# EAGLE schematic main (EAGLE 9.6.2)
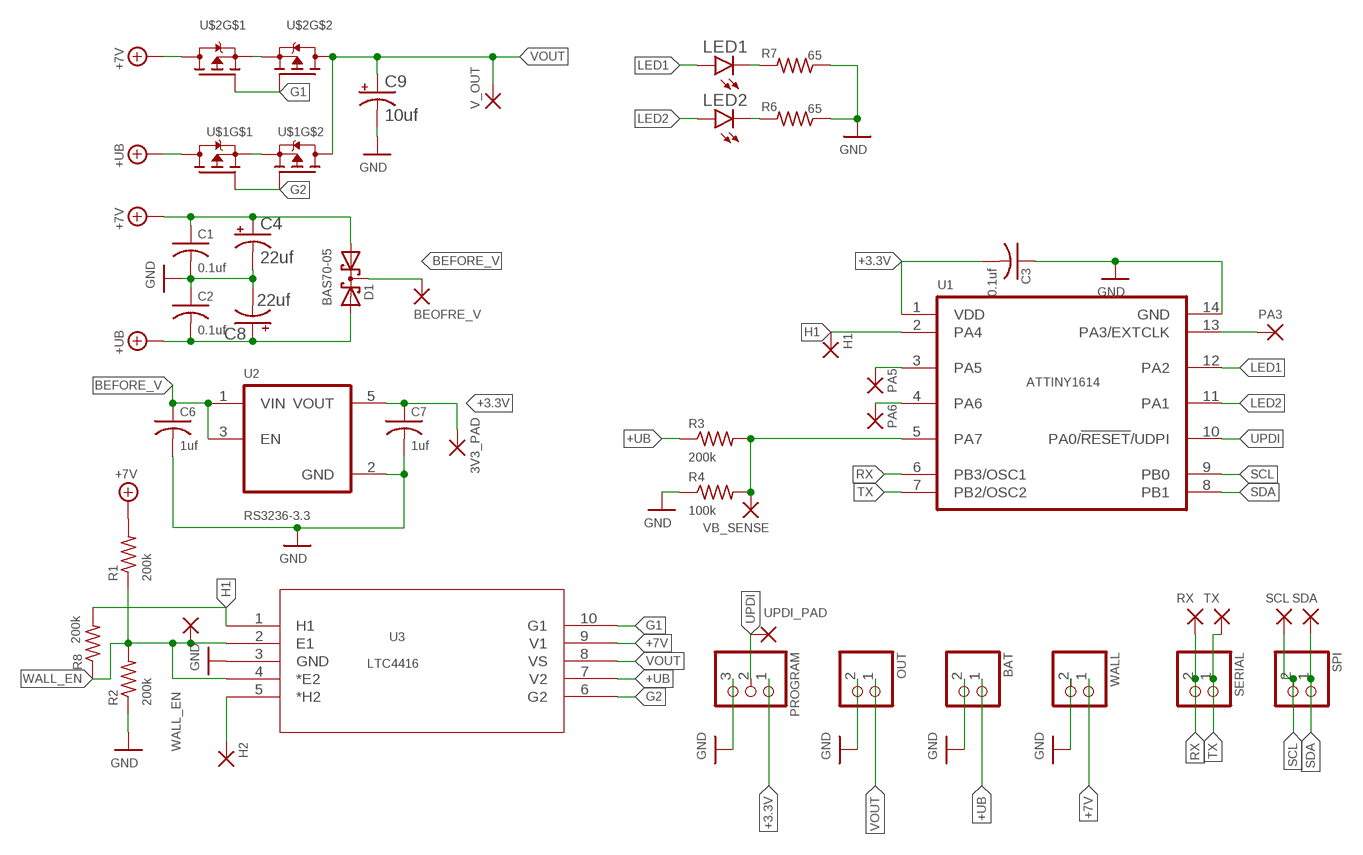
[diagram p0: schematic, sheet 1]

## Parts
3V3_PAD  SMD2  [SMD1,27-2,54]
BAT  PINHD-1X2  [1X02]
BEOFRE_V  SMD2  [SMD1,27-2,54]
C1  0.1uf  C-USC0805  [C0805]
C2  0.1uf  C-USC0805  [C0805]
C3  0.1uf  C-USC0805  [C0805]
C4  22uf  CPOL-US153CLV-0405  [153CLV-0405]
C6  1uf  C-USC1210  [C1210]
C7  1uf  C-USC1210  [C1210]
C8  22uf  CPOL-US153CLV-0405  [153CLV-0405]
C9  10uf  CPOL-US153CLV-0405  [153CLV-0405]
D1  BAS70-05  [SOT23]
H1  SMD2  [SMD1,27-2,54]
H2  SMD2  [SMD1,27-2,54]
LED1  LEDCHIP-LED0805  [CHIP-LED0805]
LED2  LEDCHIP-LED0805  [CHIP-LED0805]
OUT  PINHD-1X2  [1X02]
PA3  SMD2  [SMD1,27-2,54]
PA5  SMD2  [SMD1,27-2,54]
PA6  SMD2  [SMD1,27-2,54]
PROGRAM  PINHD-1X3  [1X03]
R1  200k  R-US_R0805  [R0805]
R2  200k  R-US_R0805  [R0805]
R3  200k  R-US_R0805  [R0805]
R4  100k  R-US_R0805  [R0805]
R6  65  R-US_R0805  [R0805]
R7  65  R-US_R0805  [R0805]
R8  200k  R-US_R0805  [R0805]
RX  SMD2  [SMD1,27-2,54]
SCL  SMD2  [SMD1,27-2,54]
SDA  SMD2  [SMD1,27-2,54]
SERIAL  PINHD-1X2  [1X02]
SPI  PINHD-1X2  [1X02]
TX  SMD2  [SMD1,27-2,54]
U1  ATTINY1614  ATTINY1614-SSNR  [SOIC127P600X175-14N]
U2  RS3236-3.3  AP2112K-3.3TRG1  [SOT95P285X140-5N]
U3  LTC4416  LTC4416IMS#PBF  [MSOP-10_MS]
U$1  IRF7314PBF  [SO-8]
U$2  IRF7314PBF  [SO-8]
UPDI_PAD  SMD2  [SMD1,27-2,54]
V_OUT  SMD2  [SMD1,27-2,54]
VB_SENSE  SMD2  [SMD1,27-2,54]
WALL  PINHD-1X2  [1X02]
WALL_EN  SMD2  [SMD1,27-2,54]

## Nets
+3.3V: 3V3_PAD.1(P) C3.2 C7.1 PROGRAM.1 U1.1(VDD) U2.5(VOUT)
+7V: C1.1 C4.+ D1.1(A1) R1.2 U3.9(V1) U$2.7(D) U$2.8(D) WALL.1
+UB: BAT.1 C2.2 C8.+ D1.2(A2) R3.1 U3.7(V2) U$1.7(D) U$1.8(D)
BEFORE_V: BEOFRE_V.1(P) C6.1 D1.3(K1K2) U2.1(VIN) U2.3(EN)
G1: U3.10(G1) U$2.2(G) U$2.4(G)
G2: U3.6(G2) U$1.2(G) U$1.4(G)
GND: BAT.2 C1.2 C2.1 C3.1 C4.- C6.2 C7.2 C8.- C9.- OUT.2 PROGRAM.3 R2.1 R4.1 R6.1 R7.1 U1.14(GND) U2.2(GND) U3.3(GND) WALL.2
H1: H1.1(P) R8.2 U1.2(PA4) U3.1(H1)
LED1: LED1.A U1.12(PA2)
LED2: LED2.A U1.11(PA1)
N$1: R3.2 R4.2 U1.5(PA7) VB_SENSE.1(P)
N$2: PA3.1(P) U1.13(PA3/EXTCLK)
N$3: U$1.1(S) U$1.3(S)
N$4: U$2.1(S) U$2.3(S)
N$5: LED2.C R6.2
N$6: H2.1(P) U3.5(*H2)
N$7: LED1.C R7.2
N$8: PA5.1(P) U1.3(PA5)
N$9: PA6.1(P) U1.4(PA6)
RX: RX.1(P) SERIAL.2 U1.6(PB3/OSC1)
SCL: SCL.1(P) SPI.2 U1.9(PB0)
SDA: SDA.1(P) SPI.1 U1.8(PB1)
TX: SERIAL.1 TX.1(P) U1.7(PB2/OSC2)
UPDI: PROGRAM.2 U1.10(PA0/!RESET!/UDPI) UPDI_PAD.1(P)
VOUT: C9.+ OUT.1 U3.8(VS) U$1.5(D) U$1.6(D) U$2.5(D) U$2.6(D) V_OUT.1(P)
WALL_EN: R1.1 R2.2 R8.1 U3.2(E1) U3.4(*E2) WALL_EN.1(P)

## Library data of the parts
3V3_PAD BEOFRE_V H1 H2 PA3 PA5 PA6 RX SCL SDA TX UPDI_PAD V_OUT VB_SENSE WALL_EN = wirepad:SMD2: SMD PAD
BAT OUT SERIAL SPI WALL = pinhead:PINHD-1X2: PIN HEADER
C1-C3 C6 C7 = rcl:C-US: CAPACITOR, American symbol; SPICEPREFIX: C
C4 C8 C9 = rcl:CPOL-US: POLARIZED CAPACITOR, American symbol; SPICEPREFIX: C
D1 = BAS70-05:BAS70-05: General-purpose Schottky diodes General-purpose Schottky diodes in small Surface-Mounted Device (SMD) plastic packages AAL Eindhoven MK Check availability <https://pricing.snapeda.com/parts/BAS70-05/NXP%20Semiconductors/view-part?ref=eda>; AVAILABILITY: In Stock; DESCRIPTION: Diode Array 1 Pair Common Cathode Schottky 70V 70mA (DC) Surface Mount TO-236-3, SC-59, SOT-23-3; MF: NXP Semiconductors; MP: BAS70-05; PACKAGE: SOT-23 ON; PRICE: None; PURCHASE-URL: https://pricing.snapeda.com/search/part/BAS70-05/?ref=eda
LED1 LED2 = led:LED: LED OSRAM: - CHIPLED LG R971, LG N971, LY N971, LG Q971, LY Q971, LO R971, LY R971 LH N974, LH R974 LS Q976, LO Q976, LY Q976 LO Q996 - Hyper CHIPLED LW Q18S LB Q993, LB Q99A, LB R99A - SideLED LS A670, LO A670, LY A670, LG A670, LP A670 LB A673, LV A673, LT A673, LW A673 LH A674 LY A675 LS A676, LA A676, LO A676, LY A676, LW A676 LS A679, LY A679, LG A679 - Hyper Micro SIDELED® LS Y876, LA Y876, LO Y876, LY Y876 LT Y87S - SmartLED LW L88C, LW L88S LB L89C, LB L89S, LG L890 LS L89K, LO L89K, LY L89K LS L896, LA L896, LO L896, LY L896 - TOPLED LS T670, LO T670, LY T670, LG T670, LP T670 LSG T670, LSP T670, LSY T670, LOP T670, LYG T670 LG T671, LOG T671, LSG T671 LB T673, LV T673, LT T673, LW T673 LH T674 LS T676, LA T676, LO T676, LY T676, LB T676, LH T676, LSB T676, LW T676 LB T67C, LV T67C, LT T67C, LS T67K, LO T67K, LY T67K, LW E67C LS E67B, LA E67B, LO E67B, LY E67B, LB E67C, LV E67C, LT E67C LW T67C LS T679, LY T679, LG T679 LS T770, LO T770, LY T770, LG T770, LP T770 LB T773, LV T773, LT T773, LW T773 LH T774 LS E675, LA E675, LY E675, LS T675 LS T776, LA T776, LO T776, LY T776, LB T776 LHGB T686 LT T68C, LB T68C - Hyper Mini TOPLED® LB M676 - Mini TOPLED Santana® LG M470 LS M47K, LO M47K, LY M47K Source: http://www.osram.convergy.de LUXEON: - LUMILED® LXK2-PW12-R00, LXK2-PW12-S00, LXK2-PW14-U00, LXK2-PW14-V00 LXK2-PM12-R00, LXK2-PM12-S00, LXK2-PM14-U00 LXK2-PE12-Q00, LXK2-PE12-R00, LXK2-PE12-S00, LXK2-PE14-T00, LXK2-PE14-U00 LXK2-PB12-K00, LXK2-PB12-L00, LXK2-PB12-M00, LXK2-PB14-N00, LXK2-PB14-P00, LXK2-PB14-Q00 LXK2-PR12-L00, LXK2-PR12-M00, LXK2-PR14-Q00, LXK2-PR14-R00 LXK2-PD12-Q00, LXK2-PD12-R00, LXK2-PD12-S00 LXK2-PH12-R00, LXK2-PH12-S00 LXK2-PL12-P00, LXK2-PL12-Q00, LXK2-PL12-R00 Source: www.luxeon.com KINGBRIGHT: KA-3528ASYC Source: www.kingbright.com
PROGRAM = pinhead:PINHD-1X3: PIN HEADER
R1-R4 R6-R8 = rcl:R-US_: RESISTOR, American symbol; SPICEPREFIX: R
U1 = CustomParts:ATTINY1614-SSNR: 20MHz, SOIC, 85C, Green, 14 SOIC .150in T/R Check availability <https://pricing.snapeda.com/parts/ATTINY1614-SSNR/Microchip/view-part?ref=eda>; AVAILABILITY: In Stock; DESCRIPTION: AVR tinyAVR™ 1, Functional Safety (FuSa) Microcontroller IC 8-Bit 20MHz 16KB (16K x 8) FLASH 14-SOIC; MF: Microchip; MP: ATTINY1614-SSNR; PACKAGE: SO-14 Microchip; PRICE: None; PURCHASE-URL: https://pricing.snapeda.com/search/part/ATTINY1614-SSNR/?ref=eda
U2 = AP2112K-3.3TRG1:AP2112K-3.3TRG1: AP2112 Series 0.6 A 3.3 V Fixed Output SMT LDO Linear Regulator - SOT23-5 Check availability <https://pricing.snapeda.com/parts/AP2112K-3.3TRG1/Diodes%20Inc./view-part?ref=eda>; AVAILABILITY: In Stock; DESCRIPTION: Linear Voltage Regulator IC Positive Fixed 1 Output 600mA SOT-25; MF: Diodes Inc.; MP: AP2112K-3.3TRG1; PACKAGE: SOT-753 Diodes Inc.; PRICE: None; PURCHASE-URL: https://pricing.snapeda.com/search/part/AP2112K-3.3TRG1/?ref=eda
U3 = LTC4416IMS_PBF:LTC4416IMS#PBF: Check availability <https://pricing.snapeda.com/parts/LTC4416IMS%23PBF/Analog%20Devices/view-part?ref=eda>; AVAILABILITY: In Stock; DESCRIPTION: OR Controller Source Selector Switch P-Channel 2:2 10-MSOP; MF: Analog Devices; MP: LTC4416IMS#PBF; PACKAGE: MSOP-10 Linear Technology; PRICE: None; PURCHASE-URL: https://pricing.snapeda.com/search/part/LTC4416IMS#PBF/?ref=eda
U$1 U$2 = IRF7314PBF:IRF7314PBF: Check availability <https://pricing.snapeda.com/parts/IRF7314PBF/Infineon/view-part?ref=eda>; AVAILABILITY: In Stock; DESCRIPTION: Mosfet Array 2 P-Channel (Dual) 20V 5.3A 2W Surface Mount 8-SO; MF: Infineon; MP: IRF7314PBF; PACKAGE: SOIC-8 International Rectifier; PRICE: None; PURCHASE-URL: https://pricing.snapeda.com/search/part/IRF7314PBF/?ref=eda